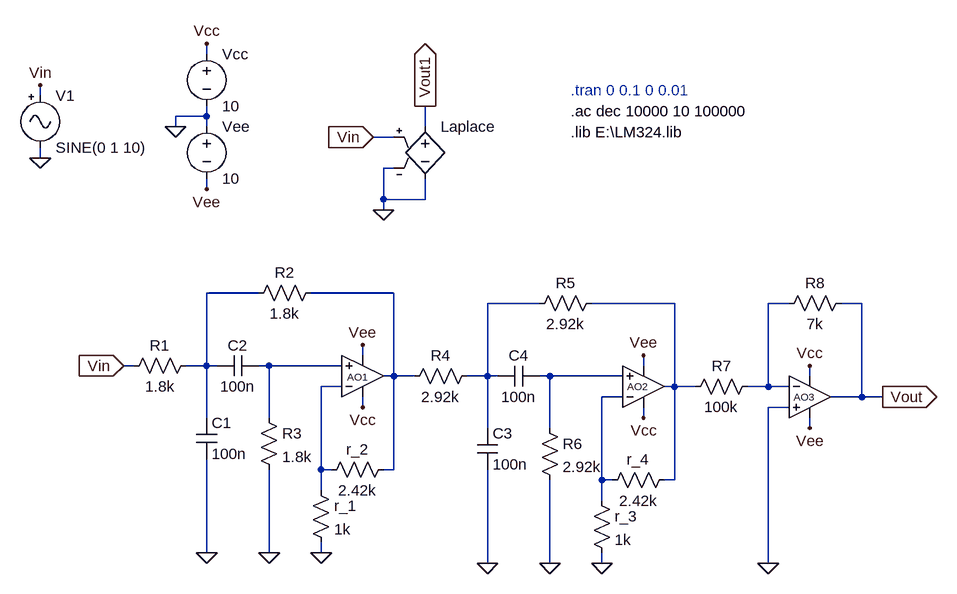
[diagram p0: schematic Filtros.asc]
Filtros.asc, the LTspice schematic file:
Version 4.1
SHEET 1 1376 680
WIRE -64 -416 -64 -432
WIRE -320 -352 -320 -368
WIRE -64 -320 -64 -336
WIRE -64 -320 -112 -320
WIRE -112 -304 -112 -320
WIRE -64 -304 -64 -320
WIRE 272 -304 272 -336
WIRE 224 -288 192 -288
WIRE -320 -256 -320 -272
WIRE 224 -240 208 -240
WIRE -64 -208 -64 -224
WIRE 208 -192 208 -240
WIRE 272 -192 272 -224
WIRE 272 -192 208 -192
WIRE 208 -176 208 -192
WIRE 16 -48 -64 -48
WIRE 224 -48 96 -48
WIRE 448 -32 368 -32
WIRE 656 -32 528 -32
WIRE 832 -32 800 -32
WIRE 944 -32 912 -32
WIRE 176 48 176 32
WIRE -176 64 -192 64
WIRE -64 64 -64 -48
WIRE -64 64 -96 64
WIRE -48 64 -64 64
WIRE 32 64 16 64
WIRE 144 64 32 64
WIRE 608 64 608 48
WIRE 224 80 224 -48
WIRE 224 80 208 80
WIRE 256 80 224 80
WIRE 368 80 368 -32
WIRE 368 80 336 80
WIRE 384 80 368 80
WIRE 464 80 448 80
WIRE 576 80 464 80
WIRE 864 80 864 64
WIRE 144 96 112 96
WIRE 656 96 656 -32
WIRE 656 96 640 96
WIRE 688 96 656 96
WIRE 800 96 800 -32
WIRE 800 96 768 96
WIRE 832 96 800 96
WIRE 576 112 544 112
WIRE 944 112 944 -32
WIRE 944 112 896 112
WIRE 976 112 944 112
WIRE 176 128 176 112
WIRE 832 128 800 128
WIRE -64 144 -64 64
WIRE 32 144 32 64
WIRE 608 144 608 128
WIRE 368 160 368 80
WIRE 464 160 464 80
WIRE 864 160 864 144
WIRE 112 224 112 96
WIRE 128 224 112 224
WIRE 224 224 224 80
WIRE 224 224 208 224
WIRE 544 240 544 112
WIRE 560 240 544 240
WIRE 656 240 656 96
WIRE 656 240 640 240
WIRE 112 256 112 224
WIRE 544 272 544 240
WIRE -64 352 -64 208
WIRE 32 352 32 224
WIRE 112 352 112 336
WIRE 368 368 368 224
WIRE 464 368 464 240
WIRE 544 368 544 352
WIRE 800 368 800 128
FLAG 176 128 Vcc
FLAG 176 32 Vee
FLAG -112 -304 0
FLAG -64 -432 Vcc
FLAG -64 -208 Vee
FLAG 112 352 0
FLAG 32 352 0
FLAG -64 352 0
FLAG 608 144 Vcc
FLAG 608 48 Vee
FLAG 544 368 0
FLAG 464 368 0
FLAG 368 368 0
FLAG -320 -368 Vin
FLAG -320 -256 0
FLAG 976 112 Vout
IOPIN 976 112 Out
FLAG 864 64 Vcc
FLAG 864 160 Vee
FLAG 800 368 0
FLAG 208 -176 0
FLAG 272 -336 Vout1
IOPIN 272 -336 Out
FLAG -192 64 Vin
IOPIN -192 64 In
FLAG 192 -288 Vin
IOPIN 192 -288 In
SYMBOL res -80 48 R90
WINDOW 0 0 56 VBottom 2
WINDOW 3 32 56 VTop 2
SYMATTR InstName R1
SYMATTR Value 1.8k
SYMBOL res 112 -64 R90
WINDOW 0 0 56 VBottom 2
WINDOW 3 32 56 VTop 2
SYMATTR InstName R2
SYMATTR Value 1.8k
SYMBOL cap -80 144 R0
SYMATTR InstName C1
SYMATTR Value 100n
SYMBOL cap 16 48 R90
WINDOW 0 0 32 VBottom 2
WINDOW 3 32 32 VTop 2
SYMATTR InstName C2
SYMATTR Value 100n
SYMBOL res 16 128 R0
SYMATTR InstName R3
SYMATTR Value 1.8k
SYMBOL res 224 208 R90
WINDOW 0 0 56 VBottom 2
WINDOW 3 32 56 VTop 2
SYMATTR InstName r_2
SYMATTR Value 2.42k
SYMBOL res 96 240 R0
SYMATTR InstName r_1
SYMATTR Value 1k
SYMBOL voltage -64 -432 R0
WINDOW 123 0 0 Left 0
WINDOW 39 0 0 Left 0
SYMATTR InstName Vcc
SYMATTR Value 10
SYMBOL voltage -64 -320 R0
WINDOW 123 0 0 Left 0
WINDOW 39 0 0 Left 0
SYMATTR InstName Vee
SYMATTR Value 10
SYMBOL res 352 64 R90
WINDOW 0 0 56 VBottom 2
WINDOW 3 32 56 VTop 2
SYMATTR InstName R4
SYMATTR Value 2.92k
SYMBOL res 544 -48 R90
WINDOW 0 0 56 VBottom 2
WINDOW 3 32 56 VTop 2
SYMATTR InstName R5
SYMATTR Value 2.92k
SYMBOL cap 352 160 R0
SYMATTR InstName C3
SYMATTR Value 100n
SYMBOL cap 448 64 R90
WINDOW 0 0 32 VBottom 2
WINDOW 3 32 32 VTop 2
SYMATTR InstName C4
SYMATTR Value 100n
SYMBOL res 448 144 R0
SYMATTR InstName R6
SYMATTR Value 2.92k
SYMBOL res 656 224 R90
WINDOW 0 0 56 VBottom 2
WINDOW 3 32 56 VTop 2
SYMATTR InstName r_4
SYMATTR Value 2.42k
SYMBOL res 528 256 R0
SYMATTR InstName r_3
SYMATTR Value 1k
SYMBOL Misc\\signal -320 -368 R0
WINDOW 39 0 0 Left 0
SYMATTR InstName V1
SYMATTR Value SINE(0 1 10)
SYMATTR Value2 AC 1
SYMBOL res 784 80 R90
WINDOW 0 0 56 VBottom 2
WINDOW 3 32 56 VTop 2
SYMATTR InstName R7
SYMATTR Value 100k
SYMBOL res 928 -48 R90
WINDOW 0 0 56 VBottom 2
WINDOW 3 32 56 VTop 2
SYMATTR InstName R8
SYMATTR Value 7k
SYMBOL e 272 -320 R0
WINDOW 3 24 44 Invisible 2
SYMATTR Value Laplace{1.642E07*s**2/(s**4 + 5080*s**3 + 9.586E07*s**2 +  2.006E11*s + 1.558E15)}
SYMATTR InstName Laplace
SYMBOL OpAmps\\opamp2 176 144 M180
WINDOW 0 -24 63 Left 1
WINDOW 3 16 96 Invisible 2
SYMATTR InstName AO1
SYMATTR Value LM324
SYMBOL OpAmps\\opamp2 608 160 M180
WINDOW 0 -25 64 Left 1
WINDOW 3 16 96 Invisible 2
SYMATTR InstName AO2
SYMATTR Value LM324
SYMBOL OpAmps\\opamp2 864 48 R0
WINDOW 0 -25 64 Left 1
WINDOW 3 16 96 Invisible 2
SYMATTR InstName AO3
SYMATTR Value LM324
TEXT 496 -360 Left 2 ;.tran 0 0.1 0 0.01
TEXT 496 -328 Left 2 !.ac dec 10000 10 100000
TEXT 496 -296 Left 2 !.lib E:\\LM324.lib

The netlist it stands for:
* Filtros.asc
R1 N001 Vin 1.8k
R2 N002 N001 1.8k
C1 N001 0 100n
C2 N006 N001 100n
R3 N006 0 1.8k
r_2 N002 N008 2.42k
r_1 N008 0 1k
Vcc Vcc 0 10
Vee 0 Vee 10
R4 N003 N002 2.92k
R5 N004 N003 2.92k
C3 N003 0 100n
C4 N007 N003 100n
R6 N007 0 2.92k
r_4 N004 N009 2.42k
r_3 N009 0 1k
V1 Vin 0 SINE(0 1 10) AC 1
R7 N005 N004 100k
R8 Vout N005 7k
E§Laplace Vout1 0 Vin 0 Laplace{1.642E07*s**2/(s**4 + 5080*s**3 + 9.586E07*s**2 +  2.006E11*s + 1.558E15)}
X§AO1 N006 N008 Vcc Vee N002 LM324  ; pins In+ In- V+ V- OUT
X§AO2 N007 N009 Vcc Vee N004 LM324  ; pins In+ In- V+ V- OUT
X§AO3 0 N005 Vcc Vee Vout LM324  ; pins In+ In- V+ V- OUT
* .tran 0 0.1 0 0.01
.ac dec 10000 10 100000
.lib E:\LM324.lib
.backanno
.end